# Altium schematic sheet Power.SchDoc
size 420 x 297 mm; Address1: Address1; Address2: Address2; Address3: Address3; Address4: Address4; DocumentNumber: АБВГ.123456.001 Э3; SheetNumber: 2; Scale: 1:1; DocumentType: Схема электрическая принципиальная; FirstReferrence: АБВГ.123456.001
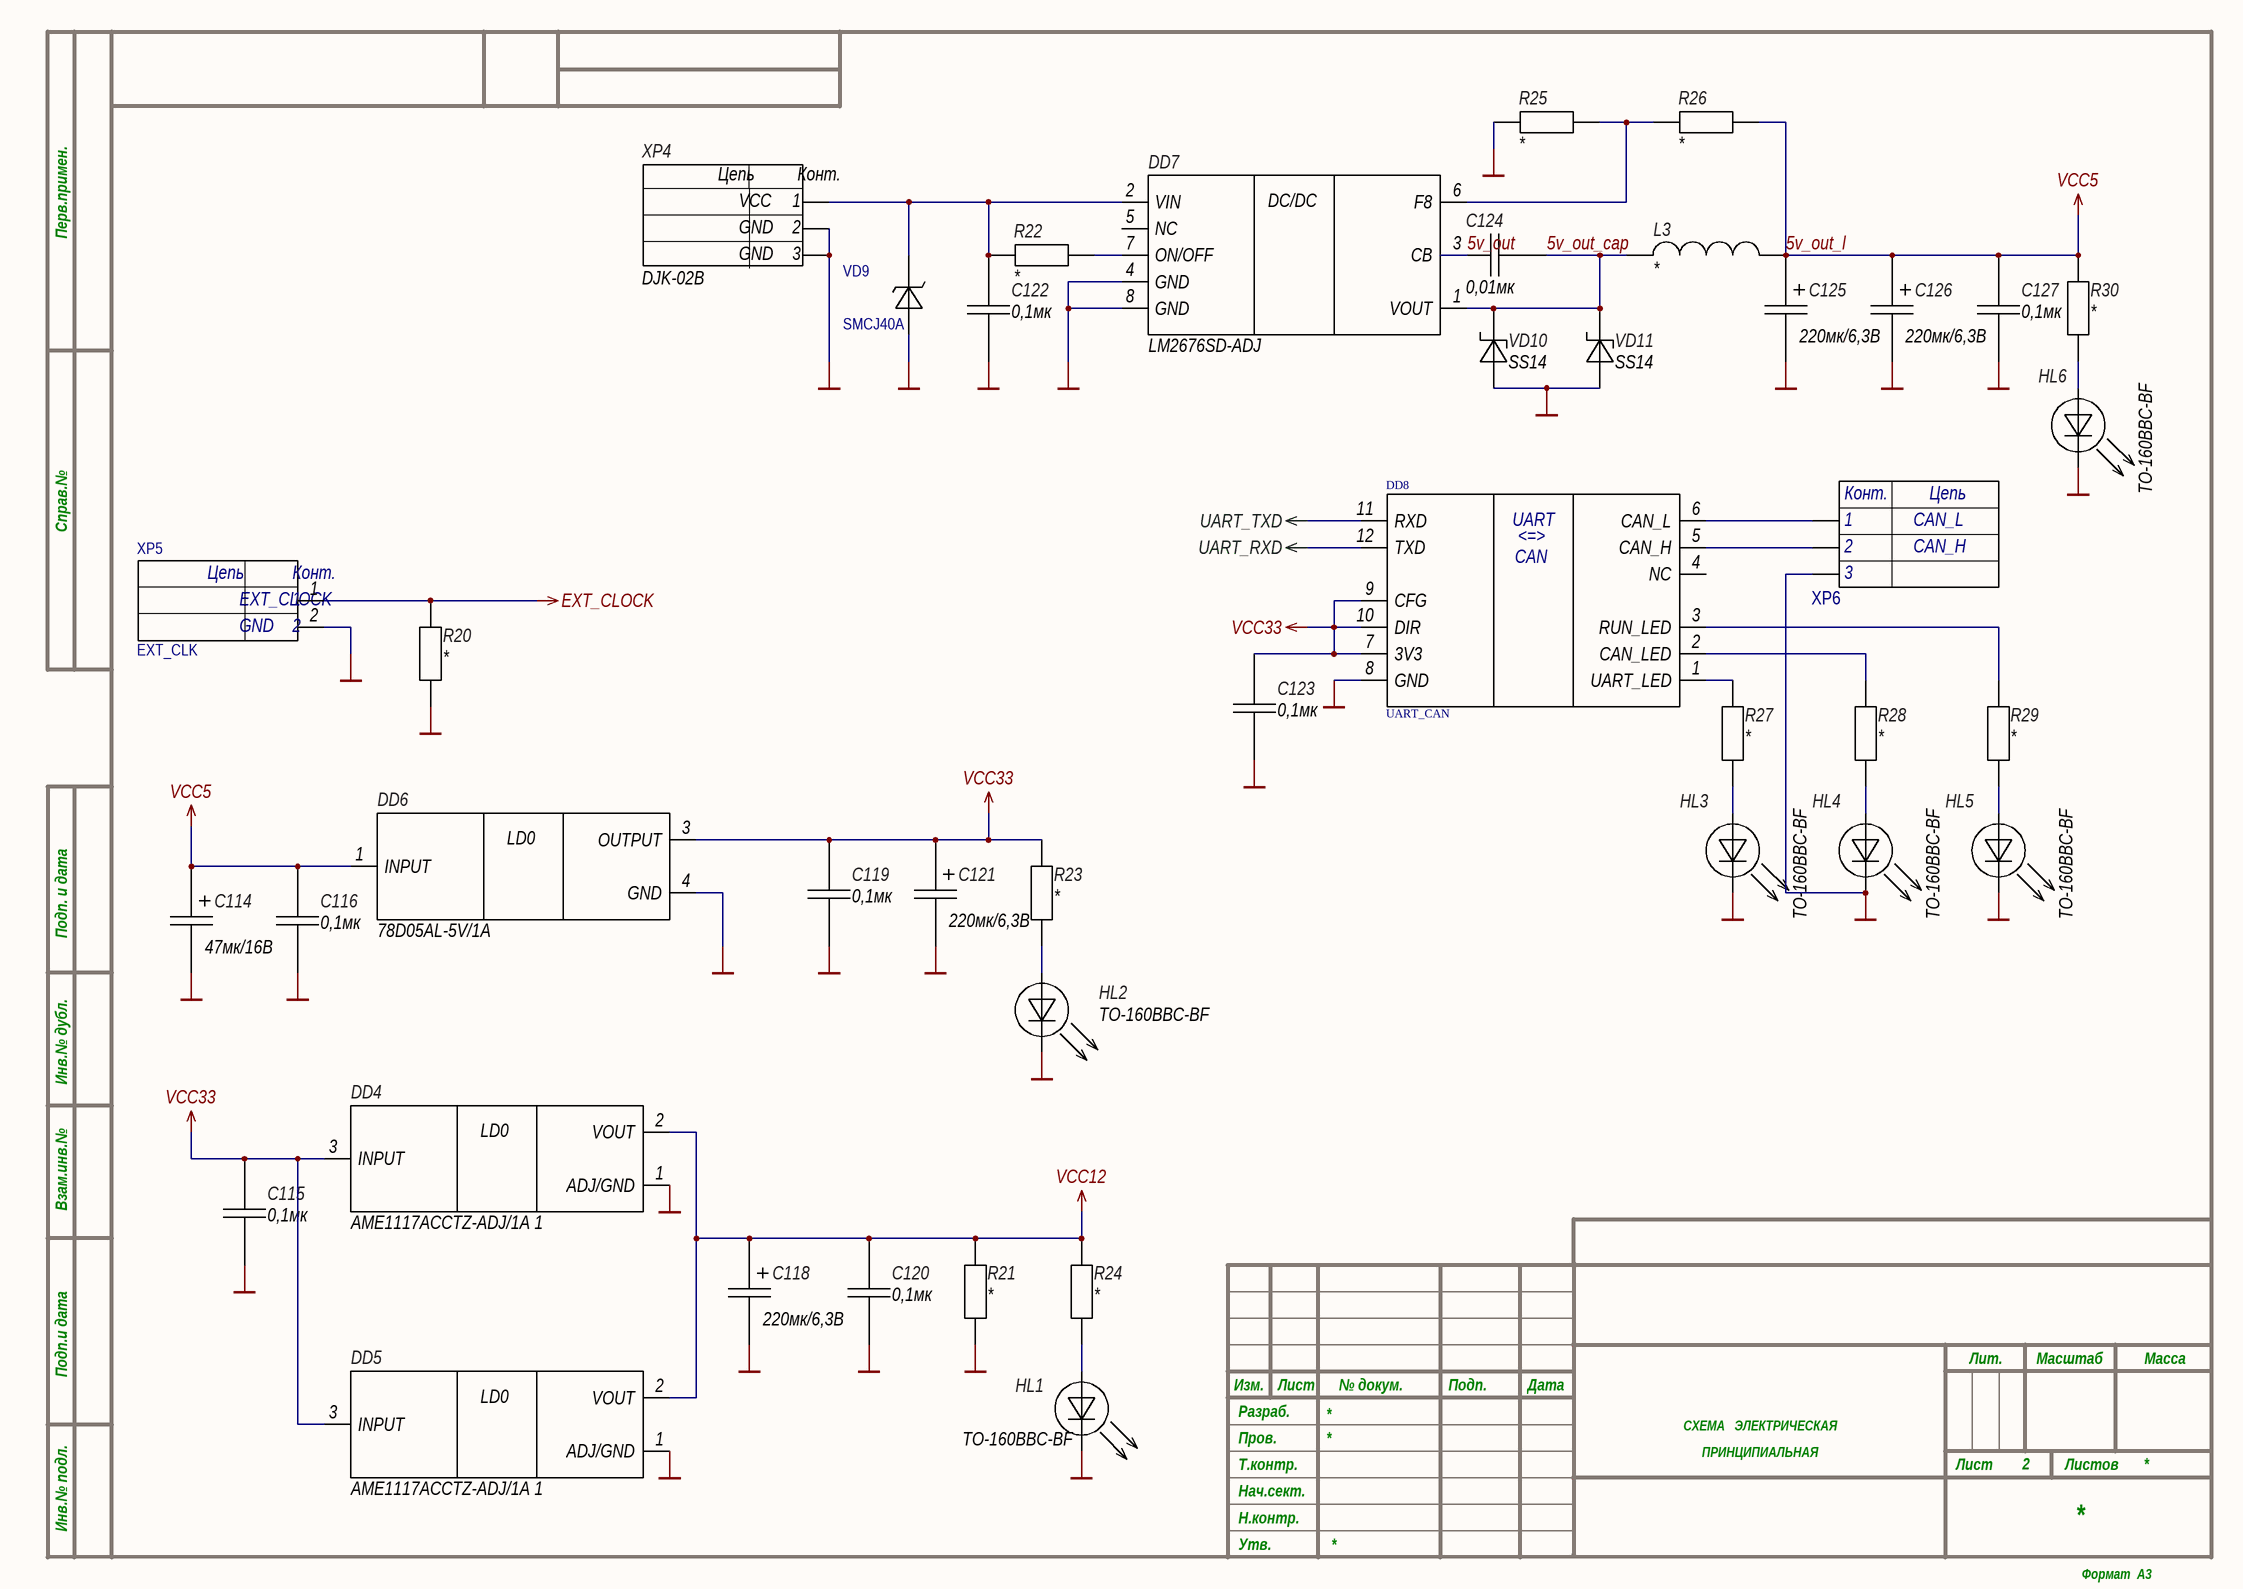
[diagram p0: Power.SchDoc]

## Parts
C114  47мк/16B  [CAPAE530X610N]
C115  0,1мк  [0603]
C116  0,1мк  [0603]
C118  220мк/6,3В  [CAPAE530X610N]
C119  0,1мк  [0603]
C120  0,1мк  [0603]
C121  220мк/6,3В  [CAPAE530X610N]
C122  0,1мк  [RESC1005X35N]
C123  0,1мк  [0603]
C124  0,01мк  [ECPU1C154MA5]
C125  220мк/6,3В  [CAPAE530X610N]
C126  220мк/6,3В  [CAPAE530X610N]
C127  0,1мк  [0603]
DD4  AME1117ACCTZ-ADJ/1A 1  [SOT230P700X180-4N]
DD5  AME1117ACCTZ-ADJ/1A 1  [SOT230P700X180-4N]
DD6  78D05AL-5V/1A  [BD750L5FPCE2]
DD7  LM2676SD-ADJ  [DFN500X600X100-15N]
DD8  UART_CAN  [UART_CAN]
HL1  TO-160BBC-BF  [15412085A9000]
HL2  TO-160BBC-BF  [15412085A9000]
HL3  TO-160BBC-BF  [15412085A9000]
HL4  TO-160BBC-BF  [15412085A9000]
HL5  TO-160BBC-BF  [15412085A9000]
HL6  TO-160BBC-BF  [15412085A9000]
L3  *  [RESC1005X35N]
R20  *  [RESC3216X75N]
R21  *  [RESC3216X75N]
R22  *  [RESC3216X75N]
R23  *  [RESC3216X75N]
R24  *  [RESC3216X75N]
R25  *  [RESC3216X75N]
R26  *  [RESC3216X75N]
R27  *  [RESC3216X75N]
R28  *  [RESC3216X75N]
R29  *  [RESC3216X75N]
R30  *  [RESC3216X75N]
VD9  SMCJ40A
VD10  SS14  [DIOM5026X262N]
VD11  SS14  [DIOM5026X262N]
XP4  DJK-02B  [DJK-02B]
XP5  EXT_CLK  [IPEX]
XP6  header2  [Header_2_phoenix]  (value not drawn)

## Nets
5v_out_l: C114.1 C116.1 C125.1 C126.1 C127.1 DD6.1(INPUT) L3.2 R26.2 R30.2  [also labelled VCC5]
EXT_CLOCK: R20.2 XP5.1
GND: C114.2 C115.2 C116.2 C118.2 C119.2 C120.2 C121.2 C122.2 C123.2 C125.2 C126.2 C127.2 DD4.1(ADJ/GND) DD5.1(ADJ/GND) DD6.4(GND) DD7.4(GND) DD7.8(GND) DD8.8(GND) HL1.2 HL2.2 HL3.2 HL4.2 HL5.2 HL6.2 R20.1 R21.1 R25.1 VD9.A VD10.2 VD11.2 XP4.2 XP4.3 XP5.2 XP6.GND
UART_RXD: DD8.12(TXD)
UART_TXD: DD8.11(RXD)
VCC12: C118.1 C120.1 DD4.2(VOUT) DD5.2(VOUT) R21.2 R24.2
VCC33: C115.1 C119.1 C121.1 C123.1 DD4.3(INPUT) DD5.3(INPUT) DD6.3(OUTPUT) DD8.7(3V3) DD8.9(CFG) DD8.10(DIR) R23.2
5v_out: C124.1 DD7.3(CB)
5v_out_cap: C124.2 DD7.1(VOUT) L3.1 VD10.1 VD11.1
NetC122_1: C122.1 DD7.2(VIN) R22.1 VD9.1 XP4.1
NetDD7_6: DD7.6(F8) R25.2 R26.1
NetDD7_7: DD7.7(ON/OFF) R22.2
NetDD8_1: DD8.1(UART_LED) R27.2
NetDD8_2: DD8.2(CAN_LED) R28.2
NetDD8_3: DD8.3(RUN_LED) R29.2
NetDD8_5: DD8.5(CAN_H) XP6.2
NetDD8_6: DD8.6(CAN_L) XP6.1
NetHL1_1: HL1.1 R24.1
NetHL2_1: HL2.1 R23.1
NetHL3_1: HL3.1 R27.1
NetHL4_1: HL4.1 R28.1
NetHL5_1: HL5.1 R29.1
NetHL6_1: HL6.1 R30.1

Not connected (* = marked no-connect by the designer): DD7 5(NC); DD8 4(NC)

## Notes on the sheet
- CAN_L
- CAN_H
- Перв.примен.
- Справ.№
- Подп. и дата
- Инв.№ дубл.
- Взам.инв.№
- Подп.и дата
- Разраб.
- Изм.
- Лист
- № докум.
- Подп.
- Дата
- Лит.
- Масштаб
- Масса
- Т.контр.
- Пров.
- СХЕМА   ЭЛЕКТРИЧЕСКАЯ
- ПРИНЦИПИАЛЬНАЯ
- Листов
- Инв.№ подл.
- Утв.
- Н.контр.
- Нач.сект.
- Формат  A3
- (in symbol 78D05AL-5V/1A) LD0
- (in symbol AME1117ACCTZ-ADJ/1A 1) LD0
- (in symbol DJK-02B_PWR_CON) Цепь; Конт.; VCC; GND
- (in symbol header2) Конт.; Цепь; 3
- (in symbol LM2676SD-ADJ) DC/DC
- (in symbol SMA_CLK) Цепь; Конт.; EXT_CLOCK; GND
- (in symbol UART_CAN) UART; <=>; CAN

## Library data of the parts
C114 = Capacitor_pol_47u/16V: ValueType: Конденсатор; Value: 47мк/16B; Tolerance: *; URL: *; Temp: *; Case: *; ValueManufacturer: *; ValueManufacturerPartNumber: *; ValueDescription: *; Dielectric: *; ESR: *; Voltage: *
C115 C116 C119 C120 C123 C127 = Capacitor_0603: ValueType: Конденсатор; Value: 0,1мк; Tolerance: *; URL: *; Temp: *; Case: *; ValueManufacturer: *; ValueManufacturerPartNumber: *; ValueDescription: *; Dielectric: *; ESR: *; Voltage: *
C118 C121 C125 C126 = Capacitor_pol_220u/6.3V: ValueType: Конденсатор; Value: 220мк/6,3В; Tolerance: *; URL: *; Temp: *; Case: *; ValueManufacturer: *; ValueManufacturerPartNumber: *; ValueDescription: *; Dielectric: *; ESR: *; Voltage: *
C122 = Capacitor_0.1u: ValueType: Конденсатор; Value: 0,1мк; Tolerance: *; URL: *; Temp: *; Case: *; ValueManufacturer: *; ValueManufacturerPartNumber: *; ValueDescription: *; Dielectric: *; ESR: *; Voltage: *
C124 = Capacitor: ValueType: Конденсатор; Value: 0,01мк; Tolerance: *; URL: *; Temp: *; Case: *; ValueManufacturer: *; ValueManufacturerPartNumber: *; ValueDescription: *; Dielectric: *; ESR: *; Voltage: *
HL1-HL6 = TO-160BBC-BF: ValueManufacturer: Foryad; ValueManufacturerPartNumber: fyls-0603urc; Temp: -40...+85; ValueType: Светодиод; Value: Синий; URL: *; Case: 0603; ValueDescription: Светодиод
L3 = Inductor: ValueType: Индуктивность; Value: *; Tolerance: *; ValueManufacturer: *; ValueManufacturerPartNumber: *; ValueDescription: *
R20 R30 = Resistor: ValueManufacturer: Yageo; ValueManufacturerPartNumber: RC0603JR-07680RL; Tolerance: 5%; Temp: -55*C..+155*C; Power: 0,1 Вт; ValueType: Резистор; Value: *; URL: *; Case: 0603; ValueDescription: *
R21 R23-R29 = Resistor_0402_1k: ValueManufacturer: Yageo; ValueManufacturerPartNumber: RC0603JR-07680RL; Tolerance: 5%; Temp: -55*C..+155*C; Power: 0,1 Вт; ValueType: Резистор; Value: *; URL: *; Case: 0603; ValueDescription: *
R22 = Resistor_1206_10k: ValueManufacturer: Yageo; ValueManufacturerPartNumber: RC0603JR-07680RL; Tolerance: 5%; Temp: -55*C..+155*C; Power: 0,1 Вт; ValueType: Резистор; Value: *; URL: *; Case: 0603; ValueDescription: *
VD9 = TVS diode
VD10 VD11 = DiodeSch_SS14-E3/61T: ValueManufacturer: Vishay; ValueType: Диод Шоттки; URL: *; Temp: *; Case: DO-214AC(SMA); ValueManufacturerPartNumber: SS14-E3/61T; ValueDescription: Диод Шоттки; Value: *
XP4 = DJK-02B_PWR_CON: ValueManufacturer: KLS; ValueType: Разъем питания; ValueManufacturerPartNumber: DJK-02B; ValueDescription: DJK-02B
XP5 = SMA_CLK